# Altium project BTL MDT.PrjPcb
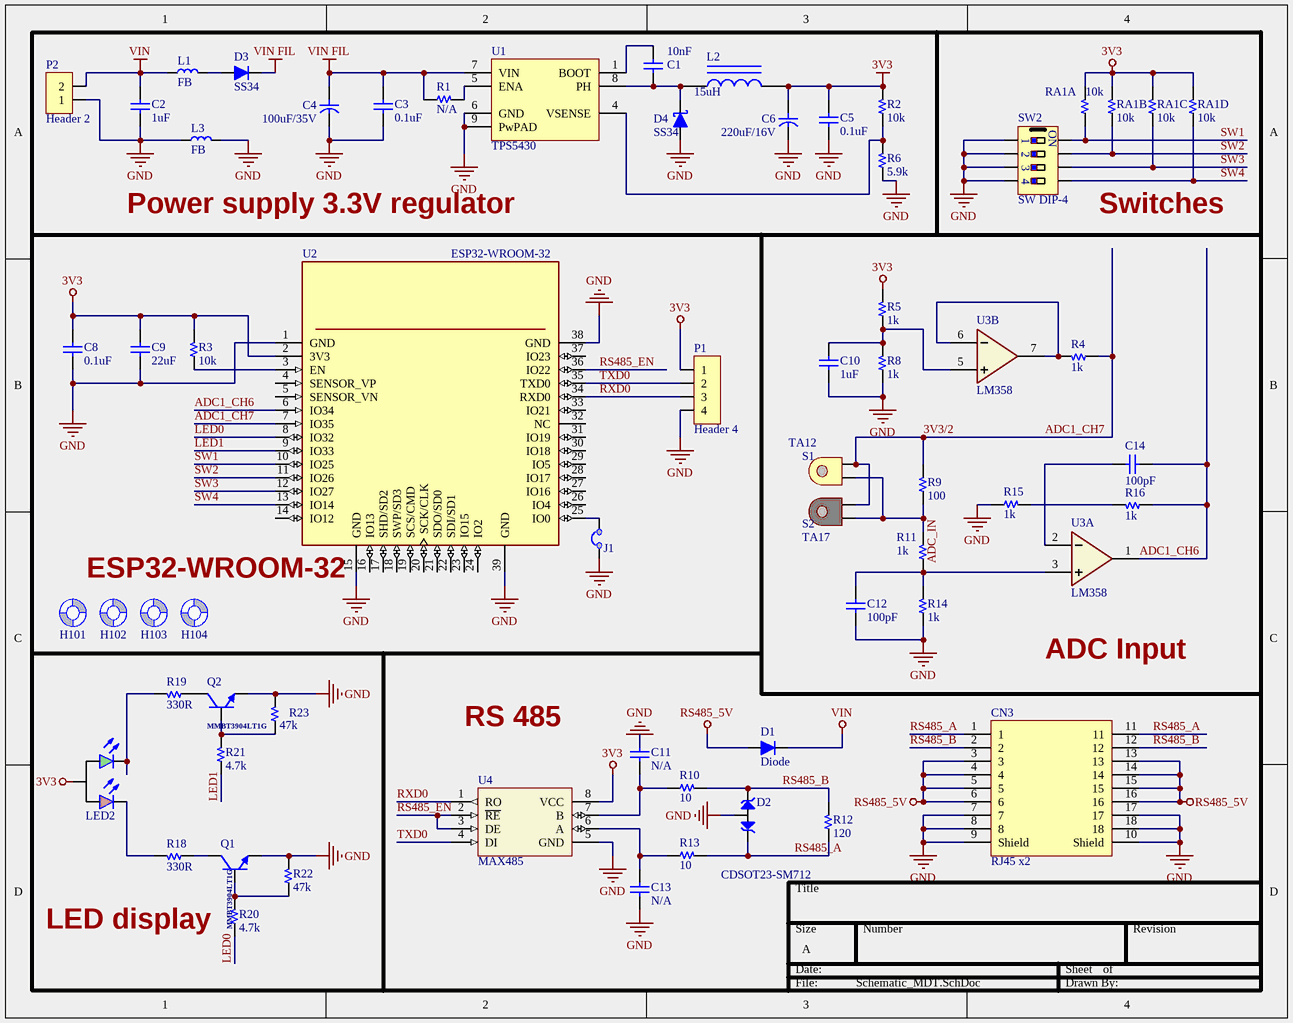
[diagram p0: Schematic_MDT.SchDoc]
1 sheet, 60 parts. Net scope: global (net labels, ports and power ports of the same name join across sheets).
Board file: PCB_MDT.PcbDoc

## Sheet Schematic_MDT.SchDoc
size A

### Parts
C1  10nF  [C 0603]
C2  1uF  [C 0805]
C3  0.1uF  [C 0603]
C4  100uF/35V  [C SMD ALU (D8)]
C5  0.1uF  [C 0603]
C6  220uF/16V  [C SMD ALU (D8)]
C8  0.1uF  [C 0603]
C9  22uF  [C 1210]
C10  1uF  [C 0603]
C11  N/A  [C 0603]
C12  100pF  [C 0603]
C13  N/A  [C 0603]
C14  100pF  [C 0603]
CN3  RJ45 x2  [CONN/RJ45/x2]
D1  Diode  [DO-214AC (SMA)]
D2  CDSOT23-SM712  [SOT-23]
D3  SS34  [DO-214AC (SMA)]
D4  SS34  [DO-214AC (SMA)]
H101  Screw Hole  [SCREW/3.2/7.0/M]  (value not drawn)  (no BOM)
H102  Screw Hole  [SCREW/3.2/7.0/M]  (value not drawn)  (no BOM)
H103  Screw Hole  [SCREW/3.2/7.0/M]  (value not drawn)  (no BOM)
H104  Screw Hole  [SCREW/3.2/7.0/M]  (value not drawn)  (no BOM)
J1  JUMP 2  [JUMP/2/Close]  (value not drawn)  (no BOM)
L1  FB  [L 0805 (2012)]
L2  value 15uH  [AXIAL-0.9]
L3  FB  [L 0805 (2012)]
LED2  Led 3pin 2color  [LED 3PIN 2COLOR 5MM]  (value not drawn)
P1  Header 4  [HDR/Header/4]
P2  Header 2  [HDR/Header/2/BOX]
Q1  MMBT3904LT1G  [SOT-23]
Q2  MMBT3904LT1G  [SOT-23]
R1  N/A  [R 0603]
R2  10k  [R 0603]
R3  10k  [R 0603]
R4  1k  [R 0603]
R5  1k  [R 0603]
R6  5.9k  [R 0603]
R8  1k  [R 0603]
R9  100  [R 0603]
R10  10  [R 0603]
R11  1k  [R 0603]
R12  120  [R 0603]
R13  10  [R 0603]
R14  1k  [R 0603]
R15  1k  [R 0603]
R16  1k  [R 0603]
R18  330R  [R 0603]
R19  330R  [R 0603]
R20  4.7k  [R 0603]
R21  4.7k  [R 0603]
R22  47k  [R 0603]
R23  47k  [R 0603]
RA1  10k  [RAx4 1206 (3216)]  (parts A,B,C,D of 4)
S1  TA12  [TA12]
S2  TA17  [TA17]
SW2  SW DIP-4  [SW/DIP4]
U1  TPS5430  [SOIC-8 EP]
U2  ESP32-WROOM-32  [MODULE_ESP32-WROOM-32]
U3  LM358  [SOIC-8]  (parts A,B of 2)
U4  MAX485  [SOIC-8]

### Nets
3V3: C5.1 C6.1 C8.1 C9.1 L2.2 LED2.2(A) P1.1 R2.2 R3.2 R5.2 RA1.5 RA1.6 RA1.7 RA1.8 U2.2(3V3) U4.8(VCC)
GND: C2.2 C3.2 C4.2 C5.2 C6.2 C8.2 C9.2 C10.2 C11.1 C12.2 C13.2 CN3.7 CN3.8 CN3.9(Shield) CN3.10(Shield) CN3.17 CN3.18 D2.3(COM) D4.1(A) J1.1 L3.1 L3.2 P1.4 P2.1 Q1.2(E) Q2.2(E) R6.1 R8.1 R14.1 R15.1 R22.2 R23.2 SW2.1 SW2.2 SW2.3 SW2.4 U1.6(GND) U1.9(PwPAD) U2.1(GND) U2.15(GND) U2.38(GND) U2.39(GND) U3.4(GND) U4.5(GND)
RS485_5V: CN3.3 CN3.4 CN3.5 CN3.6 CN3.13 CN3.14 CN3.15 CN3.16 D1.1(A)
VCC: U3.8(VCC)
VIN: C2.1 D1.2(K) L1.1 P2.2
VIN FIL: C3.1 C4.1 D3.2(K) R1.1 U1.7(VIN)
3V3/2: R4.1 R9.2 S1.2 S2.2 U2.7(IO35)  [also labelled ADC1_CH7]
ADC1_CH6: C14.2 R16.1 U2.6(IO34) U3.1(OutA)
ADC_IN: R9.1 R11.2 S1.1 S2.1
LED0: R20.1 U2.8(IO32)
LED1: R21.1 U2.9(IO33)
RS485_A: CN3.1 CN3.11 D2.1(IO1) R12.1 R13.2
RS485_B: CN3.2 CN3.12 D2.2(IO2) R10.2 R12.2
RS485_EN: U2.36(IO22) U4.2(~{RE}) U4.3(DE)
RXD0: P1.3 U2.34(RXD0) U4.1(RO)
SW1: RA1.1 SW2.8 U2.10(IO25)
SW2: RA1.2 SW2.7 U2.11(IO26)
SW3: RA1.3 SW2.6 U2.12(IO27)
SW4: RA1.4 SW2.5 U2.13(IO14)
TXD0: P1.2 U2.35(TXD0) U4.4(DI)
NetC1_1: C1.1 U1.1(BOOT)
NetC1_2: C1.2 D4.2(K) L2.1 U1.8(PH)
NetC10_1: C10.1 R5.1 R8.2 U3.5(B+)
NetC11_2: C11.2 R10.1 U4.7(B)
NetC12_1: C12.1 R11.1 R14.2 U3.3(A+)
NetC13_1: C13.1 R13.1 U4.6(A)
NetC14_1: C14.1 U3.2(A-)
NetD3_1: D3.1(A) L1.2
NetJ1_2: J1.2 U2.25(IO0)
NetLED2_1: LED2.1(RK) R18.2
NetLED2_3: LED2.3(YK) R19.2
NetQ1_1: Q1.1(B) R20.2 R22.1
NetQ1_3: Q1.3(C) R18.1
NetQ2_1: Q2.1(B) R21.2 R23.1
NetQ2_3: Q2.3(C) R19.1
NetR1_2: R1.2 U1.5(ENA)
NetR2_1: R2.1 R6.2 U1.4(VSENSE)
NetR3_1: R3.1 U2.3(EN)
NetR4_2: R4.2 U3.6(B-) U3.7(OutB)
NetR15_2: R15.2 R16.2

Not connected (* = marked no-connect by the designer): H101 1(Screw); H102 1(Screw); H103 1(Screw); H104 1(Screw); U2 4(SENSOR_VP) 5(SENSOR_VN) 14(IO12) 16(IO13) 17(SHD/SD2) 18(SWP/SD3) 19(SCS/CMD) 20(SCK/CLK) 21(SDO/SD0) 22(SDI/SD1) 23(IO15) 24(IO2) 26(IO4) 27(IO16) 28(IO17) 29(IO5) 30(IO18) 31(IO19) 32(NC) 33(IO21) 37(IO23)

### Notes on the sheet
- Power supply 3.3V regulator
- (near SW2) Switches
- (near U2) ESP32-WROOM-32
- ADC Input
- RS 485
- LED display
- (in symbol SW DIP-4) ON

### Library data of the parts
C1-C3 C5 C8-C14 = Capacitor NP: Capacitor non-pol
C4 C6 = Capacitor: Capacitor pol
CN3 = CON RJ45 x2: Connector RJ45 X2
D1 D3 = Diode: Default Diode
D2 = CDSOT23-SM712: TVS DIODE 7V/12V 14V/26V SOT23-3
D4 = Diode Schottky: Schottky Diode
J1 = JUMP 2: BOOT
L1 L3 = Inductor
L2 = Inductor Iron: Magnetic-Core Inductor; Published: 24-Mar-1999; LatestRevisionDate: 17-Jul-2002; LatestRevisionNote: Re-released for DXP Platform.; PackageReference: AXIAL-0.9; Publisher: Altium Limited; PackageDescription: Axial Device, Thru-Hole; 2 Leads; 0.9 in Pin Spacing
LED2 = Led 3pin 2color: Typical LED 3-pin 2-color
P1 = Header 4: Header, 4-Pin
P2 = Header 2: Header, 2-Pin
Q1 Q2 = Transistor NPN: NPN Bipolar Transistor
R1-R6 R8-R16 R18-R23 = Resistor
RA1 = Resistor Array x4
U1 = TPS54xx: 3/5A, Wide input range, Step-down SWIFT DC-DC Converter
U2 = ESP32-WROOM-32: Bluetooth, WiFi 802.11b/g/n, Bluetooth v4.2 + EDR, Class 1, 2 and 3 Transceiver Module 2.4GHz ~ 2.5GHz Integrated, Trace Surface Mount; MF: Espressif Systems; MP: ESP32-WROOM-32D; Price: None; Package: Module Espressif Systems; Availability: Unavailable; SnapEDA_Link: https://www.snapeda.com/parts/ESP32-WROOM-32D/Espressif%20Systems/view-part/2768115/?ref=snap; Value: *
U3 = LM358: Low Power Dual Operational Amplifiers
U4 = MAX485: Low-Power, Slew-Rate-Limited  RS-485/RS-422 Transceivers
H101-H104 = Screw Hole: TYPE: NO-BOM; UNIT PRICE: 0